# Altium schematic sheet A1-A2 Power.SchDoc: A1-A2 Power
size D; DrawnBy: C. Lewis; Engineer: C. Lewis; Address1: 4650 NORRIS CANYON RD.; Address2: SAN RAMON, CA 94583; DocumentNumber: 35133; Revision: D; SheetNumber: 7; SheetTotal: 20
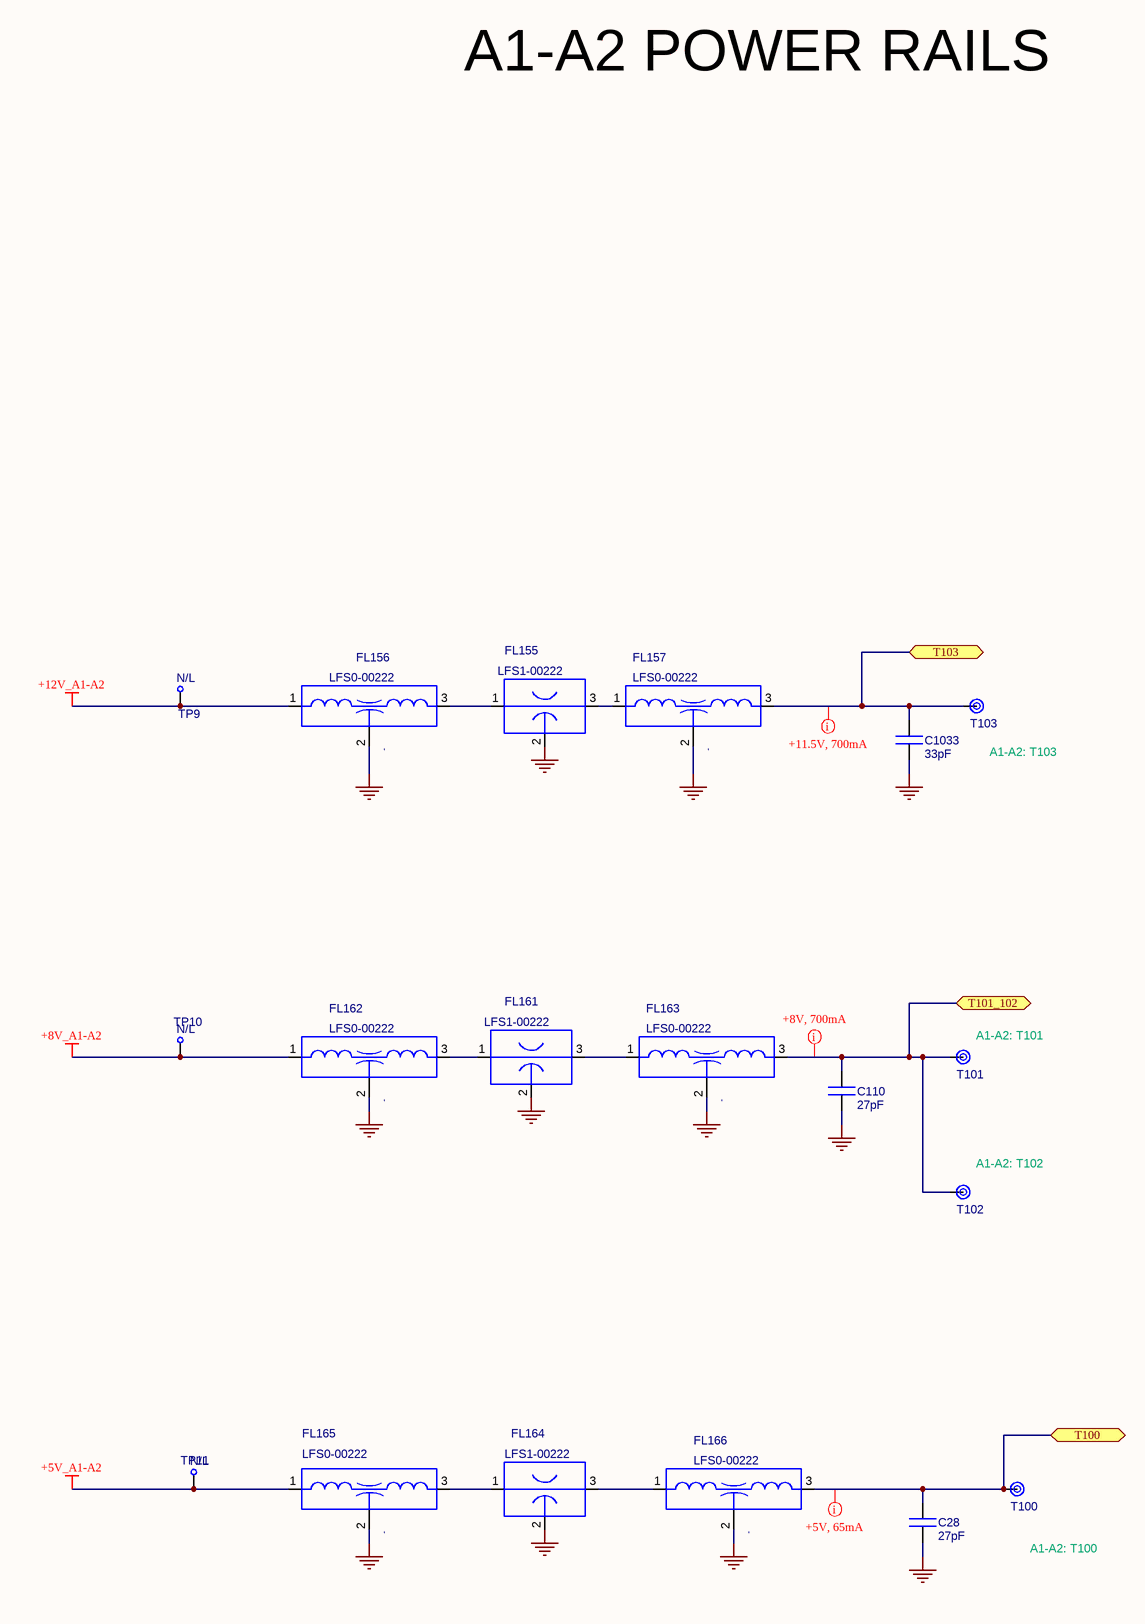
[diagram p0: A1-A2 Power.SchDoc]

## Parts
C28  value 27pF  [CAP-0402-N]  (hidden comment: 27 PF;5%;COG;>50V;CHIP;0402)
C110  value 27pF  [CAP-0402-N]  (hidden comment: 27 PF;5%;COG;>50V;CHIP;0402)
C1033  value 33pF  [CAP-0402-N]  (hidden comment: 33 PF;5%;COG;>50V;CHIP;0402)
FL155  NFM18CC222R1C3  [FIL-NFL18C]  (value not drawn)
FL156  Filter EMI 2200PF,1206  [FIL-NFE31P-1206-4P]  (value not drawn)
FL157  Filter EMI 2200PF,1206  [FIL-NFE31P-1206-4P]  (value not drawn)
FL161  NFM18CC222R1C3  [FIL-NFL18C]  (value not drawn)
FL162  Filter EMI 2200PF,1206  [FIL-NFE31P-1206-4P]  (value not drawn)
FL163  Filter EMI 2200PF,1206  [FIL-NFE31P-1206-4P]  (value not drawn)
FL164  NFM18CC222R1C3  [FIL-NFL18C]  (value not drawn)
FL165  Filter EMI 2200PF,1206  [FIL-NFE31P-1206-4P]  (value not drawn)
FL166  Filter EMI 2200PF,1206  [FIL-NFE31P-1206-4P]  (value not drawn)
T100  A1-A2: T100  [JIB0-11254]
T101  A1-A2: T101  [JIB0-11254]
T102  A1-A2: T102  [JIB0-11254]
T103  A1-A2: T103  [JIB0-11254]
TP9  NoLoad: N/L  [TP-060]  (hidden comment: .)
TP10  NoLoad: N/L  [TP-060]  (hidden comment: .)
TP11  NoLoad: N/L  [TP-060]  (hidden comment: .)

## Ports
T100, T101_102, T103

## Nets
+5V_A1-A2: FL165.1(IN) TP11.1
+8V_A1-A2: FL162.1(IN) TP10.1
+12V_A1-A2: FL156.1(IN) TP9.1
GND: C28.2 C110.1 C1033.1 FL155.2 FL156.2(GND) FL157.2(GND) FL161.2 FL162.2(GND) FL163.2(GND) FL164.2 FL165.2(GND) FL166.2(GND)
T100: C28.1 FL166.3(OUT) T100.1 ; port T100
T101_102: C110.2 FL163.3(OUT) T101.1 T102.1 ; port T101_102
T103: C1033.2 FL157.3(OUT) T103.1 ; port T103
NetFL155_1: FL155.1 FL156.3(OUT)
NetFL155_3: FL155.3 FL157.1(IN)
NetFL161_1: FL161.1 FL162.3(OUT)
NetFL161_3: FL161.3 FL163.1(IN)
NetFL164_1: FL164.1 FL165.3(OUT)
NetFL164_3: FL164.3 FL166.1(IN)

## Layout directives
net class +11.5V, 700mA: T103
net class +8V, 350mA: T101_102
net class +5V, 65mA: T100

## Notes on the sheet
- A1-A2 POWER RAILS
- Title
- Sheet Title
- PRINTED DOCUMENT IS CONSIDERED UNCONTROLLED. VERIFY REVISION IN PLM SYSTEM.
- THIS DOCUMENT CONTAINS PROPRIETARY INFORMATION. DESIGN RIGHTS BELONG TO GIGA-TRONICS AND MAY NOT BE REPRODUCED WITHOUT WRITTEN AUTHORIZATION FOR ANY REASON EXCEPT CALIBRATION, OPERATION AND MAINTENANCE.
- Size
- CAGE CODE
- Filename
- D
- Document Number
- 58900
- Date
- Sheet
- Rev
- of
- (in symbol LFS0-00222) ,

## Library data of the parts
C28 = CK40-00270: MFGR: ANY; Approved: CL; NoLoad: .; level: 1; line_number: 215; ModifyDate: 02/22/12; M_PN: ANY; G_PN: CK40-00270; item_number: CK40-00270
C110 = CK40-00270: Approved: CL; MFGR: ANY; NoLoad: .; level: 1; line_number: 215; ModifyDate: 02/22/12; G_PN: CK40-00270; M_PN: ANY; item_number: CK40-00270
C1033 = CK40-00330: Approved: CL; MFGR: ANY; NoLoad: .; level: 1; line_number: 295; ModifyDate: 3/9/13; G_PN: CK40-00330; M_PN: ANY; item_number: CK40-00330
FL155 FL161 FL164 = LFS1-00222: 2200 PF FEED THRU FILTER 0603; Value: 2200pF; Approved: NM; MFGR: muRata; NoLoad: .; level: 1; line_number: 475; G_PN: LFS1-00222; ModifyDate: 11/14/12; M_PN: NFM18CC222R1C3; item_number: LFS1-00222
FL156 FL157 FL162 FL163 FL165 FL166 = LFS0-00222: Approved: CL; NoLoad: .; M_PN: NFE31PT222Z1E9BL; MFGR: MURATA; level: 1; line_number: 335; G_PN: LFS0-00222; ModifyDate: 02/22/12; Value: 2200pF; item_number: LFS0-00222
T100-T103 = JIB0-11254: SOCKET;SINGLE;.018-.040 ID X .254;OPEN;GLD; M_PN: 380635; MFGR: AMP; NoLoad: .; Approved: NM; level: 1; line_number: 1065; ModifyDate: 11/30/12; G_PN: JIB0-11254; item_number: JIB0-11254
TP9-TP11 = TP-060: Approved: NM; level: 1; MFGR: N/A; M_PN: N/A